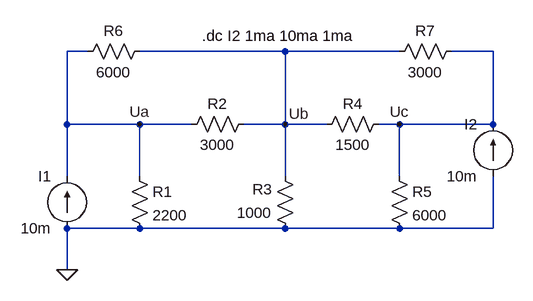
[diagram p0: schematic DemotLT1b.asc]
DemotLT1b.asc, the LTspice schematic file:
Version 4
SHEET 1 884 680
WIRE 16 -144 -16 -144
WIRE 320 -144 96 -144
WIRE 496 -144 320 -144
WIRE 640 -144 576 -144
WIRE -16 -32 -16 -144
WIRE 96 -32 -16 -32
WIRE 176 -32 96 -32
WIRE 320 -32 320 -144
WIRE 320 -32 256 -32
WIRE 384 -32 320 -32
WIRE 496 -32 464 -32
WIRE 640 -32 640 -144
WIRE 640 -32 496 -32
WIRE -16 48 -16 -32
WIRE 96 48 96 -32
WIRE 320 48 320 -32
WIRE 496 48 496 -32
WIRE 96 128 -16 128
WIRE 320 128 96 128
WIRE 496 128 320 128
WIRE 640 128 640 48
WIRE 640 128 496 128
WIRE -16 192 -16 128
FLAG -16 192 0
FLAG 96 -32 Ua
FLAG 320 -32 Ub
FLAG 496 -32 Uc
SYMBOL current -16 128 R180
WINDOW 0 24 80 Left 2
WINDOW 3 24 0 Left 2
WINDOW 123 0 0 Left 2
WINDOW 39 0 0 Left 2
SYMATTR InstName I1
SYMATTR Value 10m
SYMBOL res 80 32 R0
SYMATTR InstName R1
SYMATTR Value 2200
SYMBOL res 272 -48 R90
WINDOW 0 0 56 VBottom 2
WINDOW 3 32 56 VTop 2
SYMATTR InstName R2
SYMATTR Value 3000
SYMBOL res 336 144 R180
WINDOW 0 36 76 Left 2
WINDOW 3 36 40 Left 2
SYMATTR InstName R3
SYMATTR Value 1000
SYMBOL res 368 -16 R270
WINDOW 0 32 56 VTop 2
WINDOW 3 0 56 VBottom 2
SYMATTR InstName R4
SYMATTR Value 1500
SYMBOL res 480 32 R0
SYMATTR InstName R5
SYMATTR Value 6000
SYMBOL res 112 -160 R90
WINDOW 0 0 56 VBottom 2
WINDOW 3 32 56 VTop 2
SYMATTR InstName R6
SYMATTR Value 6000
SYMBOL res 592 -160 R90
WINDOW 0 0 56 VBottom 2
WINDOW 3 32 56 VTop 2
SYMATTR InstName R7
SYMATTR Value 3000
SYMBOL current 640 48 R180
WINDOW 0 24 80 Left 2
WINDOW 3 24 0 Left 2
WINDOW 123 0 0 Left 2
WINDOW 39 0 0 Left 2
SYMATTR InstName I2
SYMATTR Value 10m
TEXT 192 -168 Left 2 !.dc I2 1ma 10ma 1ma

The netlist it stands for:
* DemotLT1b.asc
I1 0 Ua 10m
R1 Ua 0 2200
R2 Ub Ua 3000
R3 0 Ub 1000
R4 Ub Uc 1500
R5 Uc 0 6000
R6 Ub Ua 6000
R7 Uc Ub 3000
I2 0 Uc 10m
.dc I2 1ma 10ma 1ma
.backanno
.end